# Altium schematic sheet 05_CONNECTORS.SchDoc: =TitleParameter
size A3; Address: Crete IL; Organization: ASISGUARD; Address1: Kemalpasa, Kemalpasa Cd. No:290 D:292H, 35060 Bornova/Izmir/Turkey
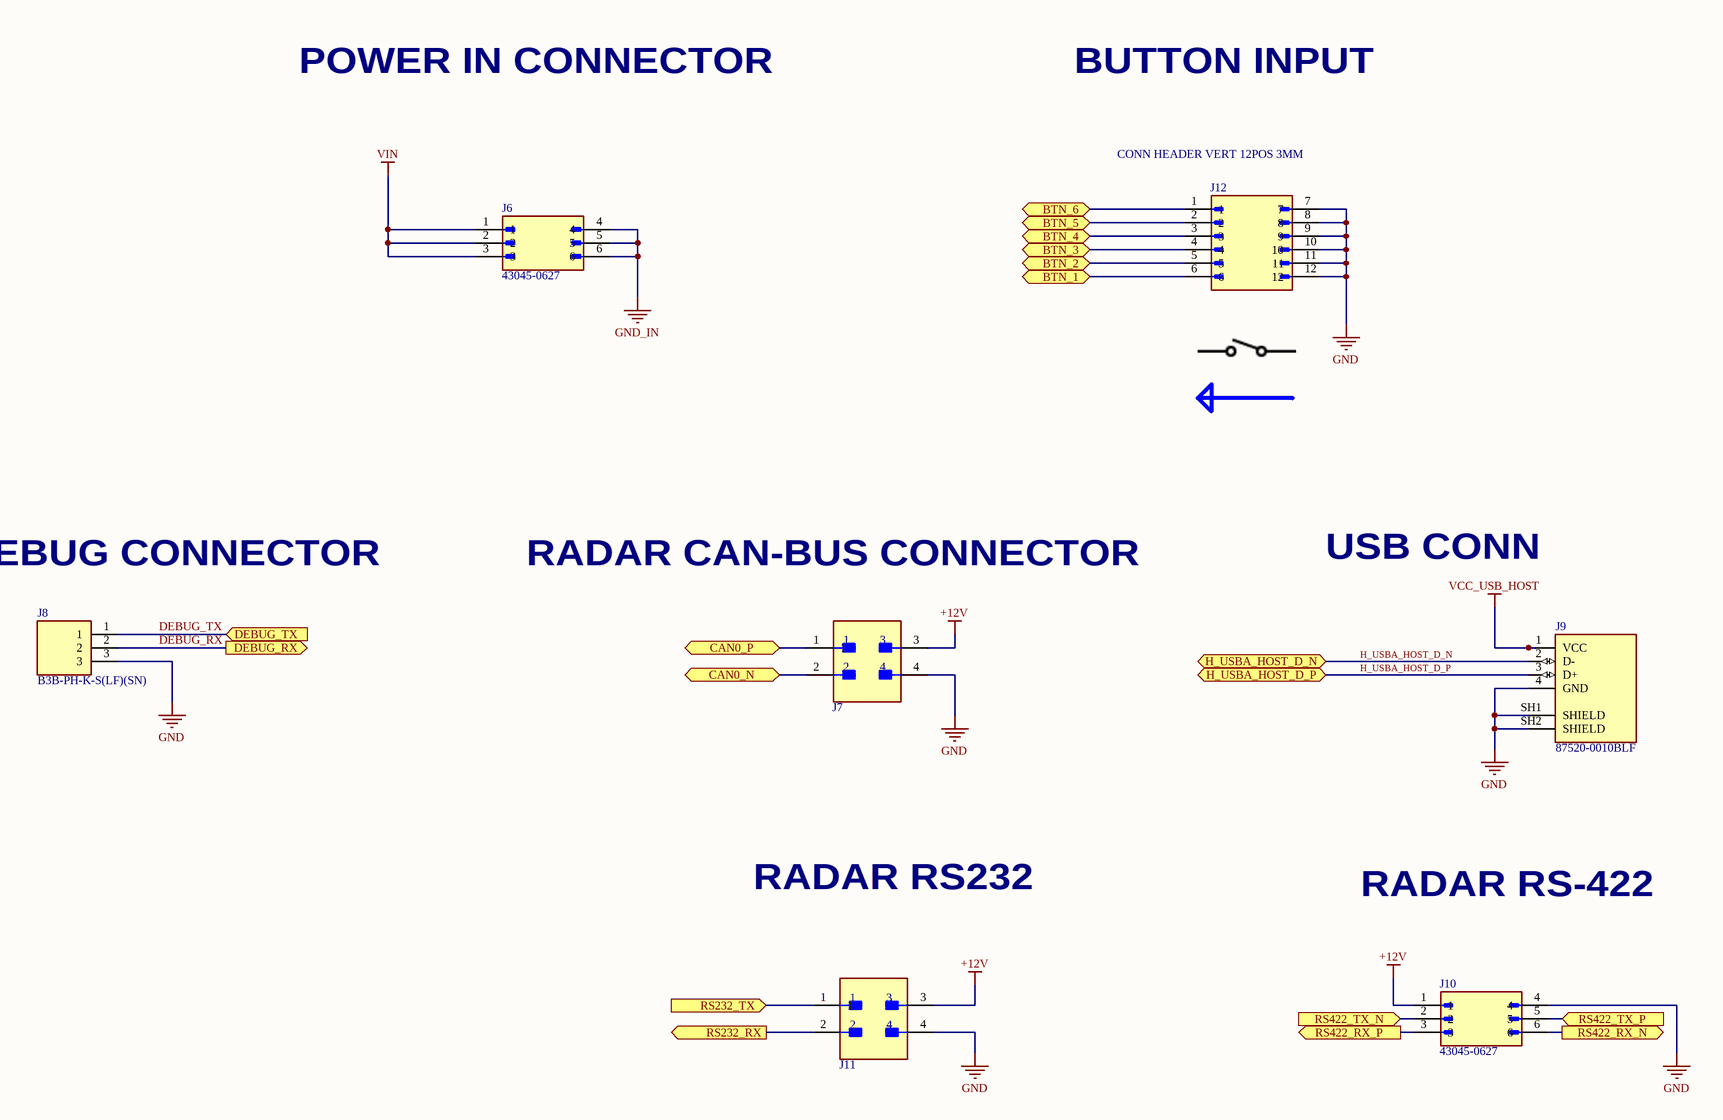
[diagram p0: 05_CONNECTORS.SchDoc]

## Parts
J6  43045-0627  [MOLEX_430450627]
J7  0430450427  [MicroFit_2x2_VERT]  (value not drawn)
J8  B3B-PH-K-S(LF)(SN)  [SHDR3W50P0X200_1X3_790X450X600P]
J9  87520-0010BLF  [AMPHENOL_87520-0010BLF]
J10  43045-0627  [MOLEX_430450627]
J11  0430450427  [MicroFit_2x2_VERT]  (value not drawn)
J12  CONN HEADER VERT 12POS 3MM  [MOLEX_430451227]

## Ports
BTN_1 (bidir), BTN_2 (bidir), BTN_3 (bidir), BTN_4 (bidir), BTN_5 (bidir), BTN_6 (bidir), CAN0_N (bidir), CAN0_P (bidir), DEBUG_RX (out), DEBUG_TX (in), H_USBA_HOST_D_N (bidir), H_USBA_HOST_D_P (bidir), RS232_RX (out), RS232_TX (in), RS422_RX_N (out), RS422_RX_P (out), RS422_TX_N (in), RS422_TX_P (in)

## Nets
+12V: J7.3 J10.1 J11.3
GND: J7.4 J8.3 J9.4(GND) J9.SH1(SHIELD) J9.SH2(SHIELD) J10.4 J11.4 J12.7 J12.8 J12.9 J12.10 J12.11 J12.12
GND_IN: J6.4 J6.5 J6.6
VCC_USB_HOST: J9.1(VCC)
VIN: J6.1 J6.2 J6.3
BTN_1: J12.6 ; port BTN_1
BTN_2: J12.5 ; port BTN_2
BTN_3: J12.4 ; port BTN_3
BTN_4: J12.3 ; port BTN_4
BTN_5: J12.2 ; port BTN_5
BTN_6: J12.1 ; port BTN_6
CAN0_N: J7.2 ; port CAN0_N
CAN0_P: J7.1 ; port CAN0_P
DEBUG_RX: J8.2 ; port DEBUG_RX
DEBUG_TX: J8.1 ; port DEBUG_TX
H_USBA_HOST_D_N: J9.2(D-) ; port H_USBA_HOST_D_N
H_USBA_HOST_D_P: J9.3(D+) ; port H_USBA_HOST_D_P
RS232_RX: J11.2 ; port RS232_RX
RS232_TX: J11.1 ; port RS232_TX
RS422_RX_N: J10.6 ; port RS422_RX_N
RS422_RX_P: J10.3 ; port RS422_RX_P
RS422_TX_N: J10.2 ; port RS422_TX_N
RS422_TX_P: J10.5 ; port RS422_TX_P

## Notes on the sheet
- POWER IN CONNECTOR
- BUTTON INPUT
- DEBUG CONNECTOR
- RADAR CAN-BUS CONNECTOR
- USB CONN
- RADAR RS232
- RADAR RS-422
- Proje/Project:
- Sayfa Adı/Document Name:
- Çizilme Tarihi/Drawing Date
- Umit KAYACIK
- Tasarlayan/Designed By
- Sayfa/Sheet:
- Revision:
- of
- Son Güncelleme/Last Edit Date
- Kontrol eden/Checked By
- Onaylayan/Approved By
- Boyut/Size:
- Varyant/Variant:
- Dil/Language:
- A3
- ENG

## Library data of the parts
J6 J10 = 43045-0627: Conn Wire to Board HDR 6 POS 3mm Solder ST Thru-Hole Micro-Fit 3.0™ Tray; Manufacturer: Molex; Current Rating: 5A; Voltage Rating: 250V; Contact Resistance: 10mR; Max Voltage Rating (DC): 250.25kV; Number of Positions: 6; Gender: Male; Glow Wire Compliant: Compliant; Supplier 1: Digikey; Manufacturer Part Number: 43045-0627; RoHS: Yes; Category: Headers and Wire Housings; Stock 1: 9980; Pricing 1: 1=1.19, 10=0.983, 80=0.81888, 1728=0.61417, 3456=0.5937 (USD); Mount: Through Hole; Contact Plating: Tin; Contact Material: Brass; Housing Material: Thermoplastic; Min Operating Temperature: -40°C; Max Operating Temperature: 105°C; Number of Rows: 2; Package Quantity: 1728; Packaging: Tray; Termination: Solder; Number of Contacts: 6; Orientation: Vertical; Number of Circuits: 6; Series: 43045; Pitch: 3mm; Row Spacing: 3mm; Reach SVHC Compliant: No; Halogen Free: Low Halogen; RoHS Compliant: Yes; Supplier Part Number 1: WM10673-ND
J7 J11 = MicroFit_2x2_VERT: Connector Header Through Hole 4 position 0.118" (3.00mm); Manufacturer: Molex; Manufacturer Part Number: 0430450427
J8 = B3B-PH-K-S_LF__SN_: Connector; Manufacturer_Name: JST (JAPAN SOLDERLESS TERMINALS); Datasheet Link: http://www.jst-mfg.com/product/pdf/eng/ePH.pdf; Height: 6mm; Manufacturer_Part_Number: B3B-PH-K-S(LF)(SN); LCSC Manufacturer Part Number: B3B-PH-K-S(LF)(SN); Arrow Part Number: B3B-PH-K-S(LF)(SN); Arrow Price/Stock: https://www.arrow.com/en/products/b3b-ph-k-s-lf-sn/jst-manufacturing; LCSC Part Number: C131339
J9 = 87520-0010BLF: USB 2.0, Input Output Connector, USB Type A, Standard, Right Angle, Through Hole, Single Decks, 4 Positions; Manufacturer: Amphenol ICC / FCI; Supplier 1: Digikey; Manufacturer Part Number: 87520-0010BLF; RoHS: No; Category: USB Connectors; Stock 1: 17622; Pricing 1: 1=0.95, 10=0.806, 42=0.7569, 84=0.72393, 252=0.65813, 504=0.5923, 1008=0.52649, 2520=0.47713 (USD); ComponentLink1URL: https://datasheet.octopart.com/87520-0010BLF-Areva-datasheet-144648.pdf?src-supplier=Digikey; ComponentLink1Description: https://datasheet.octopart.com/87520-0010BLF-Areva-datasheet-144648.pdf?src-supplier=Digikey; ComponentLink2URL: https://datasheet.octopart.com/87520-0010BLF-Areva-datasheet-154125.pdf?src-supplier=Mouser; ComponentLink2Description: https://datasheet.octopart.com/87520-0010BLF-Areva-datasheet-154125.pdf?src-supplier=Mouser; ComponentLink3URL: https://datasheet.octopart.com/87520-0010BLF-Amphenol-Communications-Solutions-datasheet-13707174.pdf?src-supplier=Farnell; ComponentLink3Description: https://datasheet.octopart.com/87520-0010BLF-Amphenol-Communications-Solutions-datasheet-13707174.pdf?src-supplier=Farnell; ComponentLink4URL: https://datasheet.octopart.com/87520-0010BLF-Areva-datasheet-21380287.pdf?src-supplier=Element14; ComponentLink4Description: https://datasheet.octopart.com/87520-0010BLF-Areva-datasheet-21380287.pdf?src-supplier=Element14; ComponentLink5URL: https://datasheet.octopart.com/87520-0010BLF-Areva-datasheet-10049120.pdf?src-supplier=Newark; ComponentLink5Description: https://datasheet.octopart.com/87520-0010BLF-Areva-datasheet-10049120.pdf?src-supplier=Newark; ComponentLink6URL: https://datasheet.octopart.com/87520-0010BLF-Amphenol-Communications-Solutions-datasheet-168215140.pdf?src-supplier=TME; ComponentLink6Description: https://datasheet.octopart.com/87520-0010BLF-Amphenol-Communications-Solutions-datasheet-168215140.pdf?src-supplier=TME; ComponentLink7URL: https://datasheet.octopart.com/87520-0010BLF-Amphenol-Communications-Solutions-datasheet-100449257.pdf?src-supplier=Electro+Sonic; ComponentLink7Description: https://datasheet.octopart.com/87520-0010BLF-Amphenol-Communications-Solutions-datasheet-100449257.pdf?src-supplier=Electro+Sonic; Supplier Part Number 1: 609-1045-ND
J12 = 43045-1227: Conn Power HDR 12 POS 3mm Solder ST Thru-Hole 12 Terminal 1 Port Micro-Fit 3.0™ Frame; Manufacturer: Molex; Current Rating: 5A; Voltage Rating: 600V; Number of Positions: 12; Gender: Male; Glow Wire Compliant: Compliant; Supplier 1: Digikey; Manufacturer Part Number: 43045-1227; RoHS: Yes; Category: Headers and Wire Housings; Stock 1: 5235; Pricing 1: 1=2.93, 10=2.578, 80=2.05088, 1008=1.69926, 3024=1.58207 (USD); Contact Plating: Tin; Contact Material: Brass; Housing Material: Thermoplastic; Number of Rows: 2; Packaging: Tray; Package Quantity: 1008; Termination: Through Hole; Number of Contacts: 12; Orientation: Vertical; Number of Circuits: 12; Series: 43045; Pitch: 3mm; Row Spacing: 3mm; Halogen Free: Low Halogen; RoHS Compliant: Yes; ComponentLink1URL: https://datasheet.ciiva.com/13676/0430451227-pcb-headers-143012-13676689.pdf?src-supplier=Mouser; ComponentLink1Description: https://datasheet.ciiva.com/13676/0430451227-pcb-headers-143012-13676689.pdf?src-supplier=Mouser; ComponentLink2URL: https://datasheet.ciiva.com/7814/1629779-7814795.pdf?src-supplier=Element14; ComponentLink2Description: https://datasheet.ciiva.com/7814/1629779-7814795.pdf?src-supplier=Element14; Supplier Part Number 1: WM10697-ND